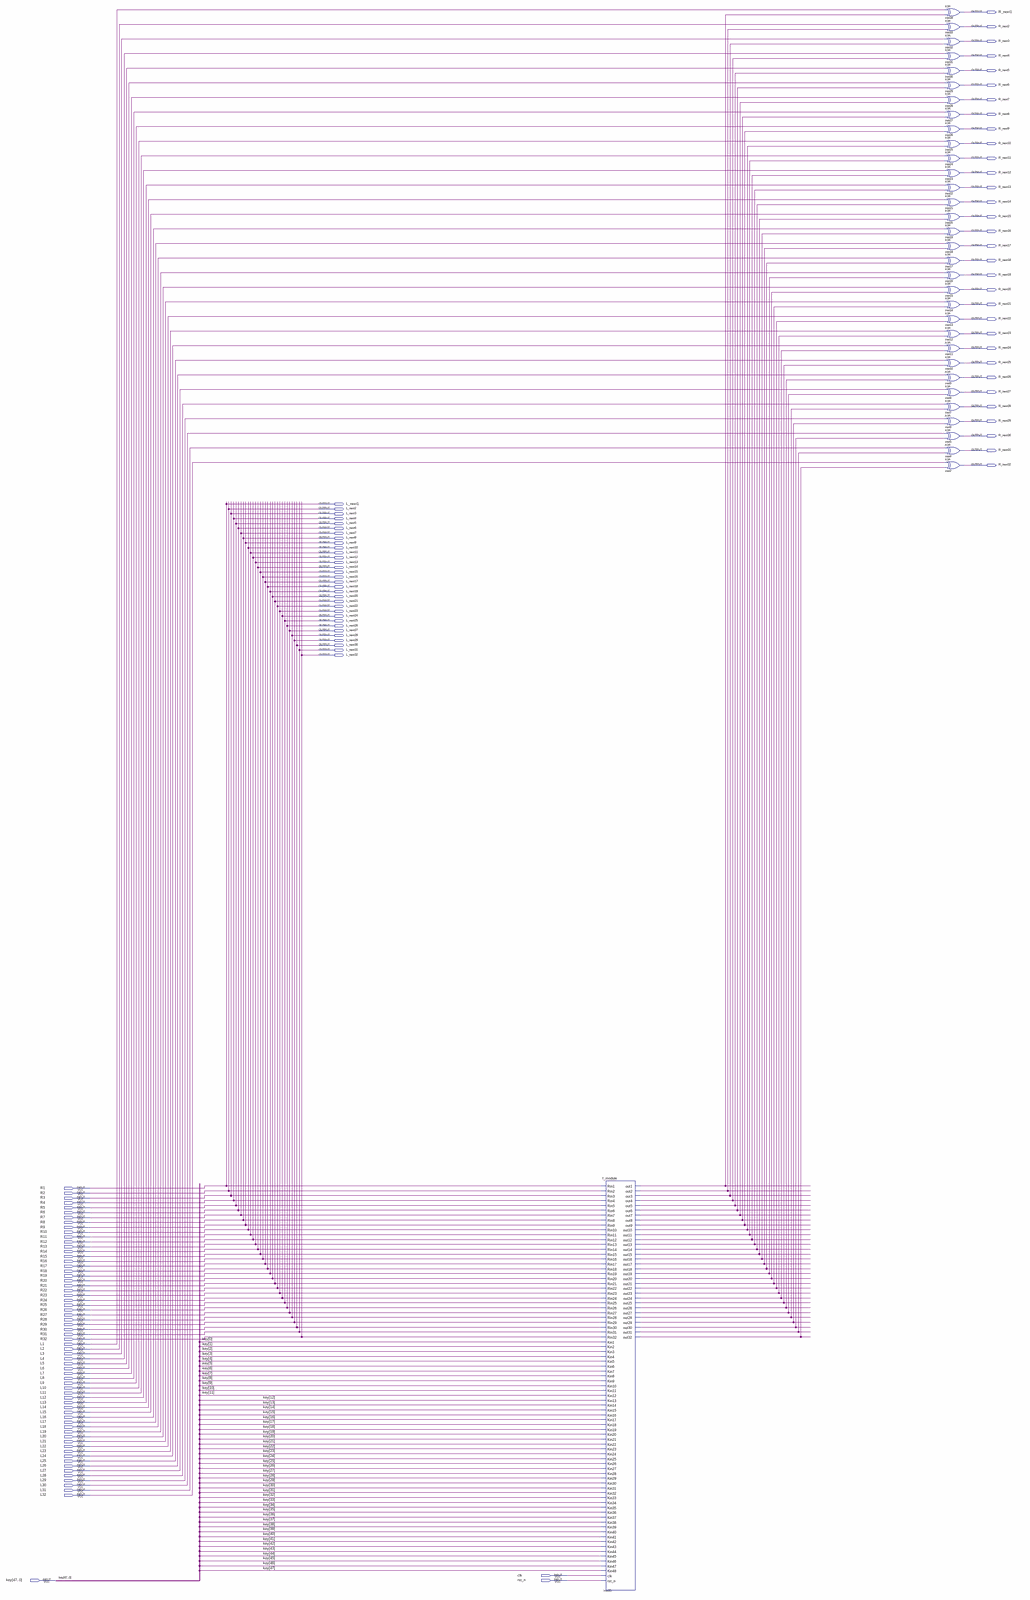
[diagram p0: schematic sheet, whole]
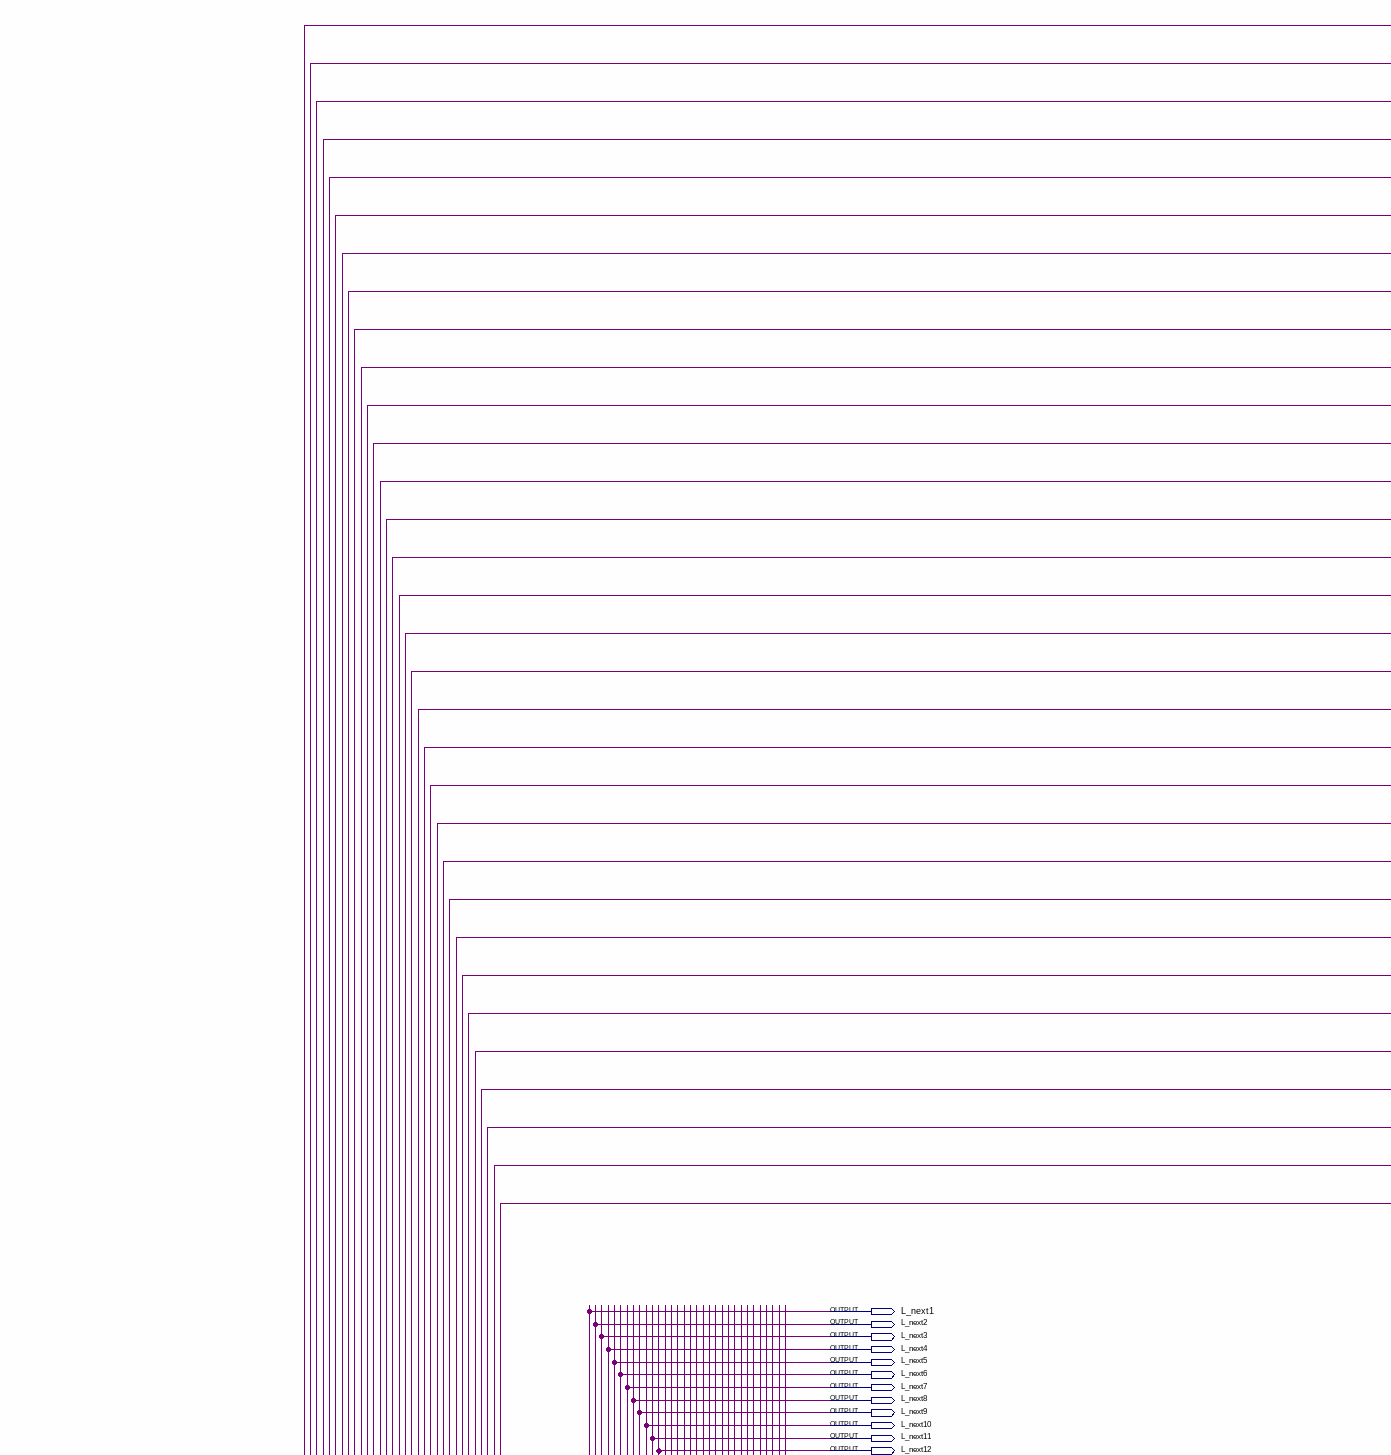
[diagram p1: schematic sheet, upper left part]
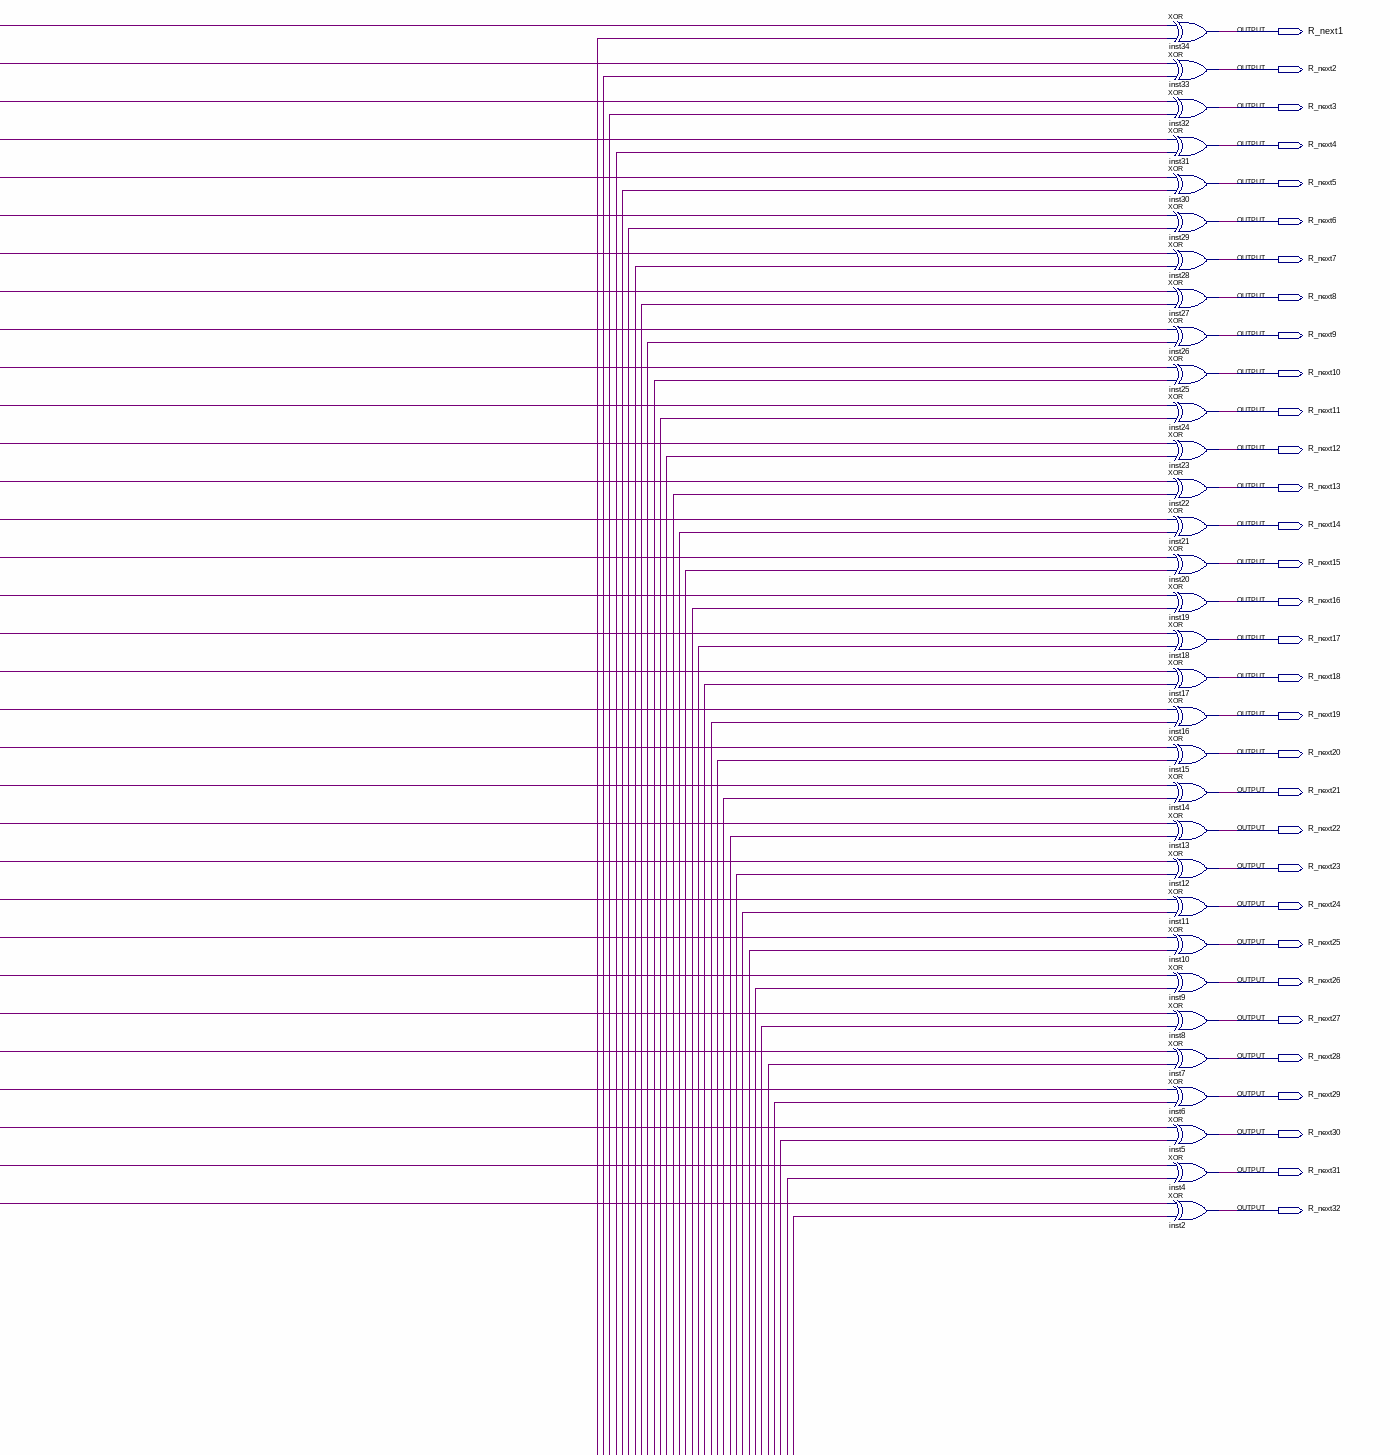
[diagram p2: schematic sheet, upper right part]
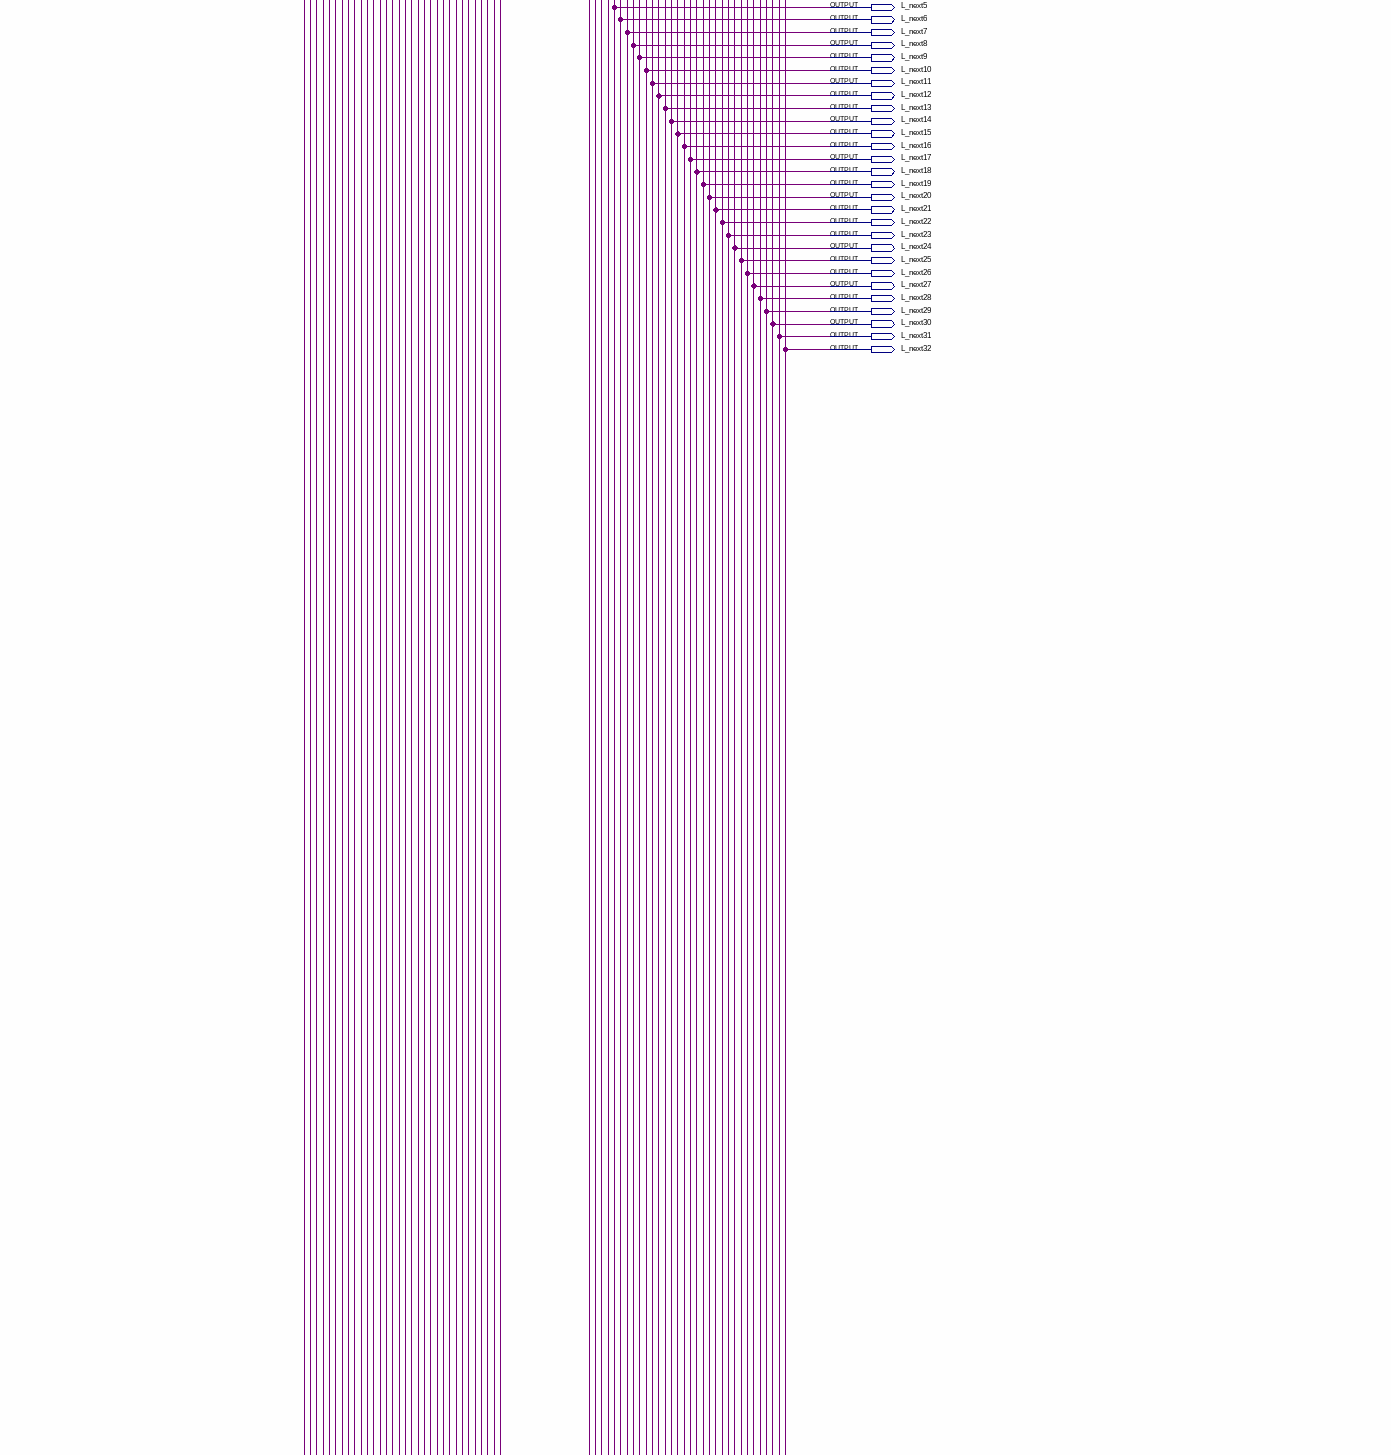
[diagram p3: schematic sheet, middle left part]
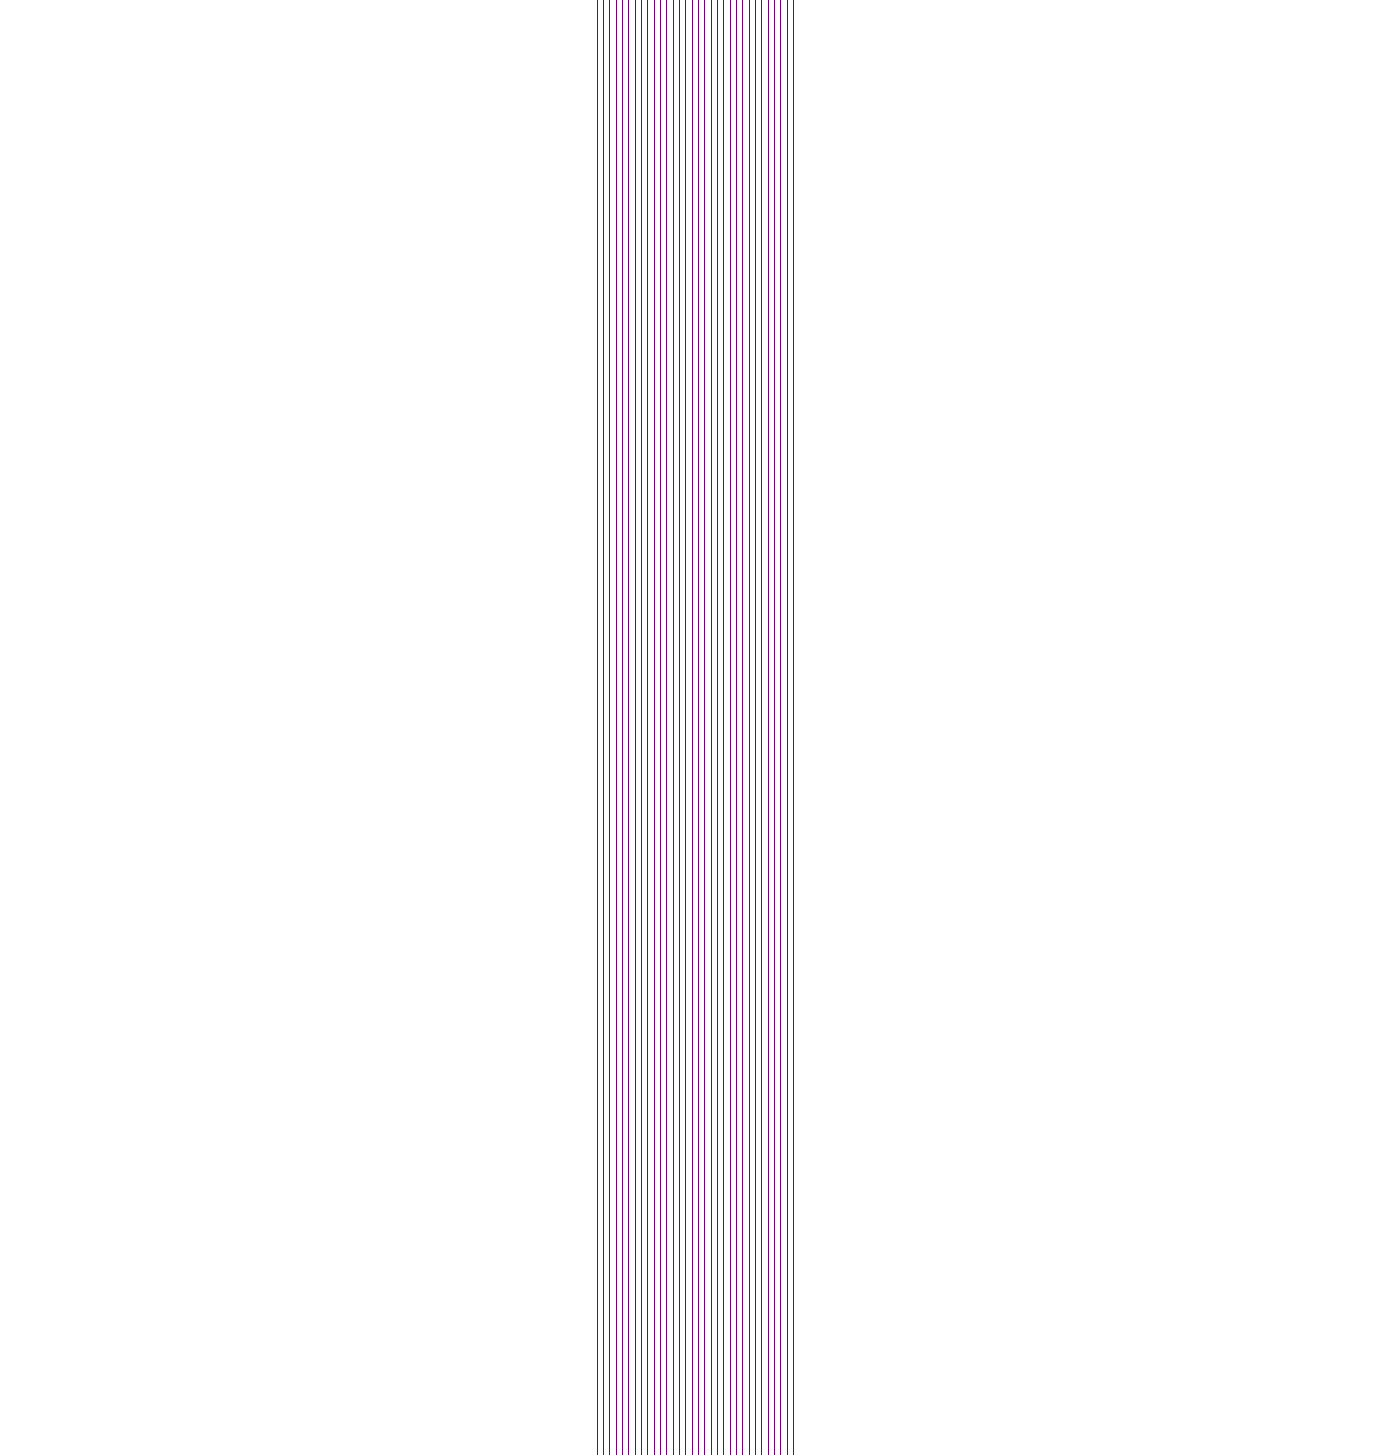
[diagram p4: schematic sheet, middle right part]
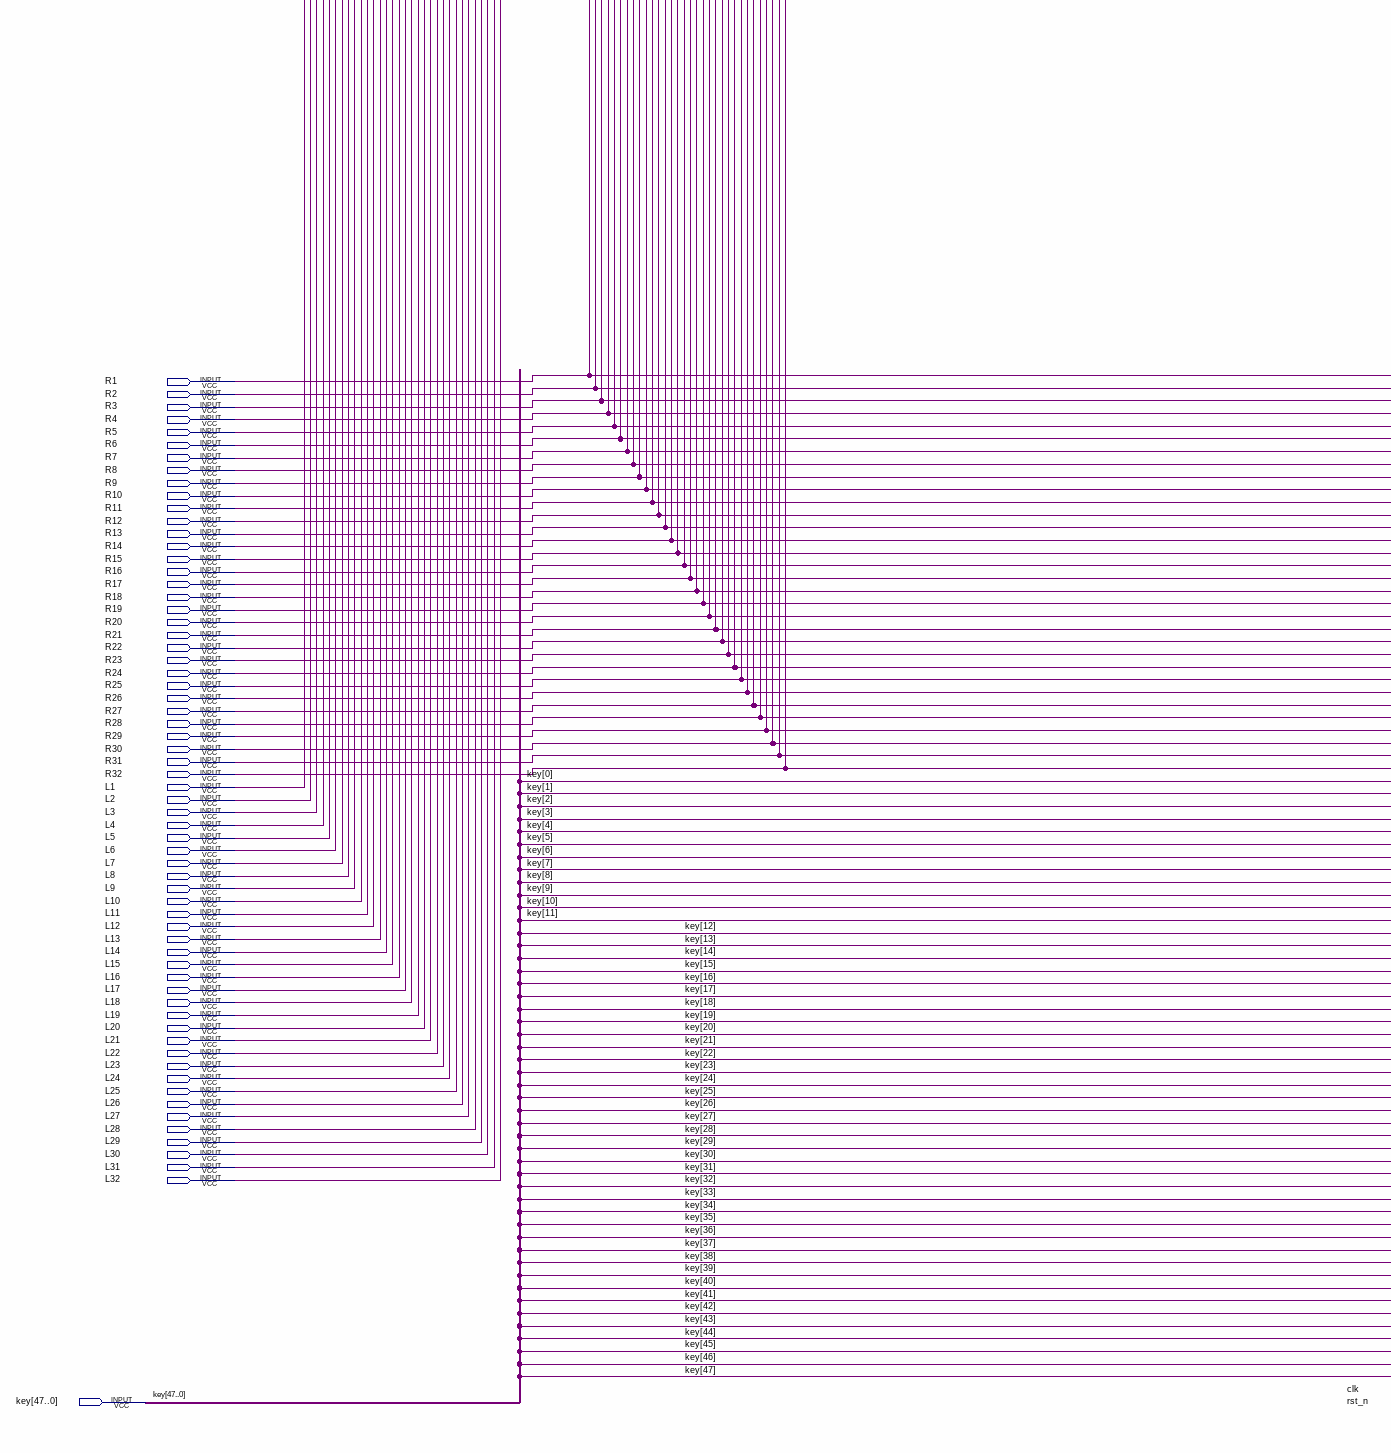
[diagram p5: schematic sheet, lower left part]
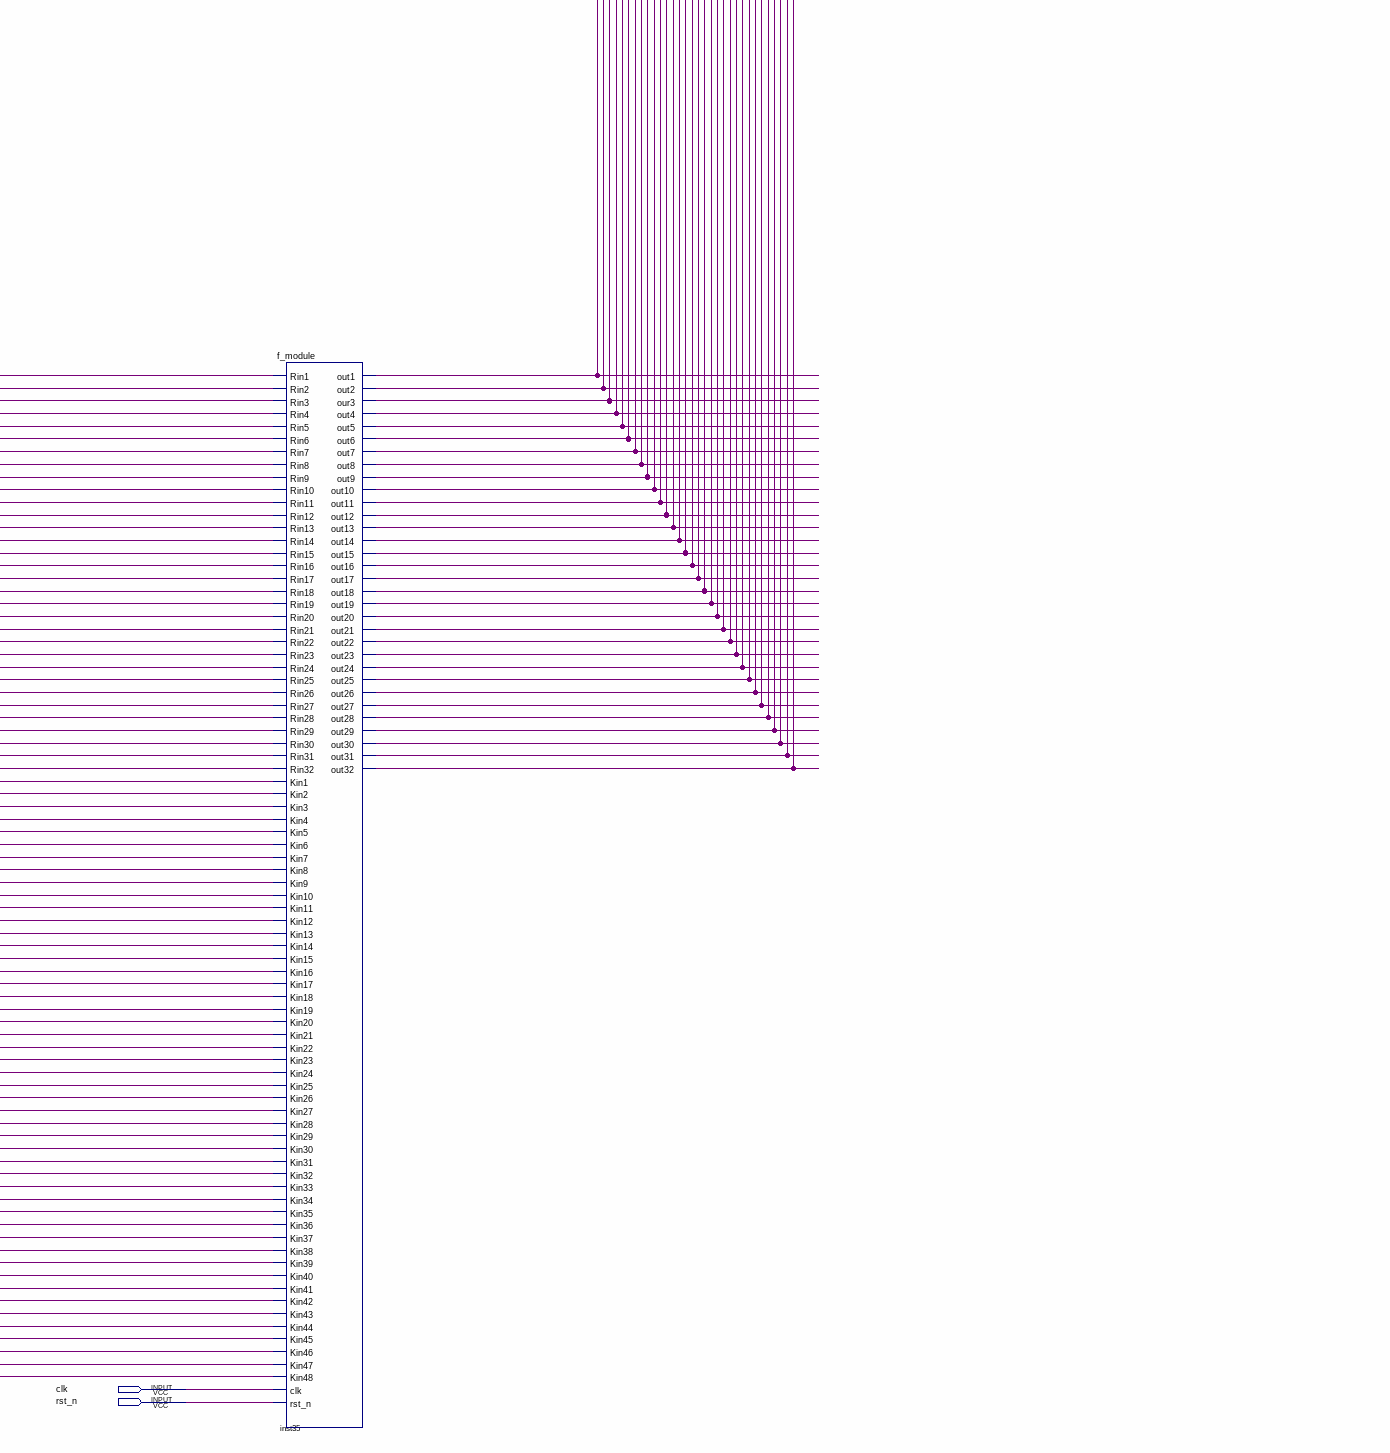
[diagram p6: schematic sheet, lower right part]
// Quartus schematic round.bdf as structural Verilog: 33 symbols, 131 pins
module round (
  input  R1,
  input  R2,
  input  R3,
  input  R4,
  input  R5,
  input  R6,
  input  R7,
  input  R8,
  input  R9,
  input  R10,
  input  R11,
  input  R12,
  input  R13,
  input  R14,
  input  R15,
  input  R16,
  input  R17,
  input  R18,
  input  R19,
  input  R20,
  input  R21,
  input  R22,
  input  R23,
  input  R24,
  input  R25,
  input  R26,
  input  R27,
  input  R28,
  input  R29,
  input  R30,
  input  R31,
  input  R32,
  input  L1,
  input  L2,
  input  L3,
  input  L4,
  input  L5,
  input  L6,
  input  L7,
  input  L8,
  input  L9,
  input  L10,
  input  L11,
  input  L12,
  input  L13,
  input  L14,
  input  L15,
  input  L16,
  input  L17,
  input  L18,
  input  L19,
  input  L20,
  input  L21,
  input  L22,
  input  L23,
  input  L24,
  input  L25,
  input  L26,
  input  L27,
  input  L28,
  input  L29,
  input  L30,
  input  L31,
  input  L32,
  input  clk,
  input  [47:0] key,
  input  rst_n,
  output R_next1,
  output R_next2,
  output R_next3,
  output R_next4,
  output R_next5,
  output R_next6,
  output R_next7,
  output R_next8,
  output R_next9,
  output R_next10,
  output R_next11,
  output R_next12,
  output R_next13,
  output R_next14,
  output R_next15,
  output R_next16,
  output R_next17,
  output R_next18,
  output R_next19,
  output R_next20,
  output R_next21,
  output R_next22,
  output R_next23,
  output R_next24,
  output R_next25,
  output R_next26,
  output R_next27,
  output R_next28,
  output R_next29,
  output R_next30,
  output R_next31,
  output R_next32,
  output L_next1,
  output L_next2,
  output L_next3,
  output L_next4,
  output L_next5,
  output L_next6,
  output L_next7,
  output L_next8,
  output L_next9,
  output L_next10,
  output L_next11,
  output L_next12,
  output L_next13,
  output L_next14,
  output L_next15,
  output L_next16,
  output L_next17,
  output L_next18,
  output L_next19,
  output L_next20,
  output L_next21,
  output L_next22,
  output L_next23,
  output L_next24,
  output L_next25,
  output L_next26,
  output L_next27,
  output L_next28,
  output L_next29,
  output L_next30,
  output L_next31,
  output L_next32
);

  wire inst35_our3, inst35_out1, inst35_out2, inst35_out4, inst35_out5, inst35_out6, inst35_out7,
       inst35_out8, inst35_out9, inst35_out10, inst35_out11, inst35_out12, inst35_out13, inst35_out14,
       inst35_out15, inst35_out16, inst35_out17, inst35_out18, inst35_out19, inst35_out20, inst35_out21,
       inst35_out22, inst35_out23, inst35_out24, inst35_out25, inst35_out26, inst35_out27, inst35_out28,
       inst35_out29, inst35_out30, inst35_out31, inst35_out32;

  f_module inst35 (
    .Rin1(R1), .Rin2(R2), .Rin3(R3), .Rin4(R4), .Rin5(R5), .Rin6(R6), .Rin7(R7), .Rin8(R8), .Rin9(R9),
    .Rin10(R10), .Rin11(R11), .Rin12(R12), .Rin13(R13), .Rin14(R14), .Rin15(R15), .Rin16(R16), .Rin17(R17),
    .Rin18(R18), .Rin19(R19), .Rin20(R20), .Rin21(R21), .Rin22(R22), .Rin23(R23), .Rin24(R24), .Rin25(R25),
    .Rin26(R26), .Rin27(R27), .Rin28(R28), .Rin29(R29), .Rin30(R30), .Rin31(R31), .Rin32(R32), .Kin1(key[0]),
    .Kin2(key[1]), .Kin3(key[2]), .Kin4(key[3]), .Kin5(key[4]), .Kin6(key[5]), .Kin7(key[6]), .Kin8(key[7]),
    .Kin9(key[8]), .Kin10(key[9]), .Kin11(key[10]), .Kin12(key[11]), .Kin13(key[12]), .Kin14(key[13]),
    .Kin15(key[14]), .Kin16(key[15]), .Kin17(key[16]), .Kin18(key[17]), .Kin19(key[18]), .Kin20(key[19]),
    .Kin21(key[20]), .Kin22(key[21]), .Kin23(key[22]), .Kin24(key[23]), .Kin25(key[24]), .Kin26(key[25]),
    .Kin27(key[26]), .Kin28(key[27]), .Kin29(key[28]), .Kin30(key[29]), .Kin31(key[30]), .Kin32(key[31]),
    .Kin33(key[32]), .Kin34(key[33]), .Kin35(key[34]), .Kin36(key[35]), .Kin37(key[36]), .Kin38(key[37]),
    .Kin39(key[38]), .Kin40(key[39]), .Kin41(key[40]), .Kin42(key[41]), .Kin43(key[42]), .Kin44(key[43]),
    .Kin45(key[44]), .Kin46(key[45]), .Kin47(key[46]), .Kin48(key[47]), .clk(clk), .rst_n(rst_n),
    .out1(inst35_out1), .out2(inst35_out2), .our3(inst35_our3), .out4(inst35_out4), .out5(inst35_out5),
    .out6(inst35_out6), .out7(inst35_out7), .out8(inst35_out8), .out9(inst35_out9), .out10(inst35_out10),
    .out11(inst35_out11), .out12(inst35_out12), .out13(inst35_out13), .out14(inst35_out14),
    .out15(inst35_out15), .out16(inst35_out16), .out17(inst35_out17), .out18(inst35_out18),
    .out19(inst35_out19), .out20(inst35_out20), .out21(inst35_out21), .out22(inst35_out22),
    .out23(inst35_out23), .out24(inst35_out24), .out25(inst35_out25), .out26(inst35_out26),
    .out27(inst35_out27), .out28(inst35_out28), .out29(inst35_out29), .out30(inst35_out30),
    .out31(inst35_out31), .out32(inst35_out32));
  xor inst34 (R_next1, L1, inst35_out1);
  xor inst33 (R_next2, L2, inst35_out2);
  xor inst32 (R_next3, L3, inst35_our3);
  xor inst31 (R_next4, L4, inst35_out4);
  xor inst30 (R_next5, L5, inst35_out5);
  xor inst29 (R_next6, L6, inst35_out6);
  xor inst28 (R_next7, L7, inst35_out7);
  xor inst27 (R_next8, L8, inst35_out8);
  xor inst26 (R_next9, L9, inst35_out9);
  xor inst25 (R_next10, L10, inst35_out10);
  xor inst24 (R_next11, L11, inst35_out11);
  xor inst23 (R_next12, L12, inst35_out12);
  xor inst22 (R_next13, L13, inst35_out13);
  xor inst21 (R_next14, L14, inst35_out14);
  xor inst20 (R_next15, L15, inst35_out15);
  xor inst19 (R_next16, L16, inst35_out16);
  xor inst18 (R_next17, L17, inst35_out17);
  xor inst17 (R_next18, L18, inst35_out18);
  xor inst16 (R_next19, L19, inst35_out19);
  xor inst15 (R_next20, L20, inst35_out20);
  xor inst14 (R_next21, L21, inst35_out21);
  xor inst13 (R_next22, L22, inst35_out22);
  xor inst12 (R_next23, L23, inst35_out23);
  xor inst11 (R_next24, L24, inst35_out24);
  xor inst10 (R_next25, L25, inst35_out25);
  xor inst9 (R_next26, L26, inst35_out26);
  xor inst8 (R_next27, L27, inst35_out27);
  xor inst7 (R_next28, L28, inst35_out28);
  xor inst6 (R_next29, L29, inst35_out29);
  xor inst5 (R_next30, L30, inst35_out30);
  xor inst4 (R_next31, L31, inst35_out31);
  xor inst2 (R_next32, L32, inst35_out32);

  assign L_next1 = R1;
  assign L_next2 = R2;
  assign L_next3 = R3;
  assign L_next4 = R4;
  assign L_next5 = R5;
  assign L_next6 = R6;
  assign L_next7 = R7;
  assign L_next8 = R8;
  assign L_next9 = R9;
  assign L_next10 = R10;
  assign L_next11 = R11;
  assign L_next12 = R12;
  assign L_next13 = R13;
  assign L_next14 = R14;
  assign L_next15 = R15;
  assign L_next16 = R16;
  assign L_next17 = R17;
  assign L_next18 = R18;
  assign L_next19 = R19;
  assign L_next20 = R20;
  assign L_next21 = R21;
  assign L_next22 = R22;
  assign L_next23 = R23;
  assign L_next24 = R24;
  assign L_next25 = R25;
  assign L_next26 = R26;
  assign L_next27 = R27;
  assign L_next28 = R28;
  assign L_next29 = R29;
  assign L_next30 = R30;
  assign L_next31 = R31;
  assign L_next32 = R32;
endmodule
